# EAGLE design led_backpack_5947 (EAGLE 6.1)
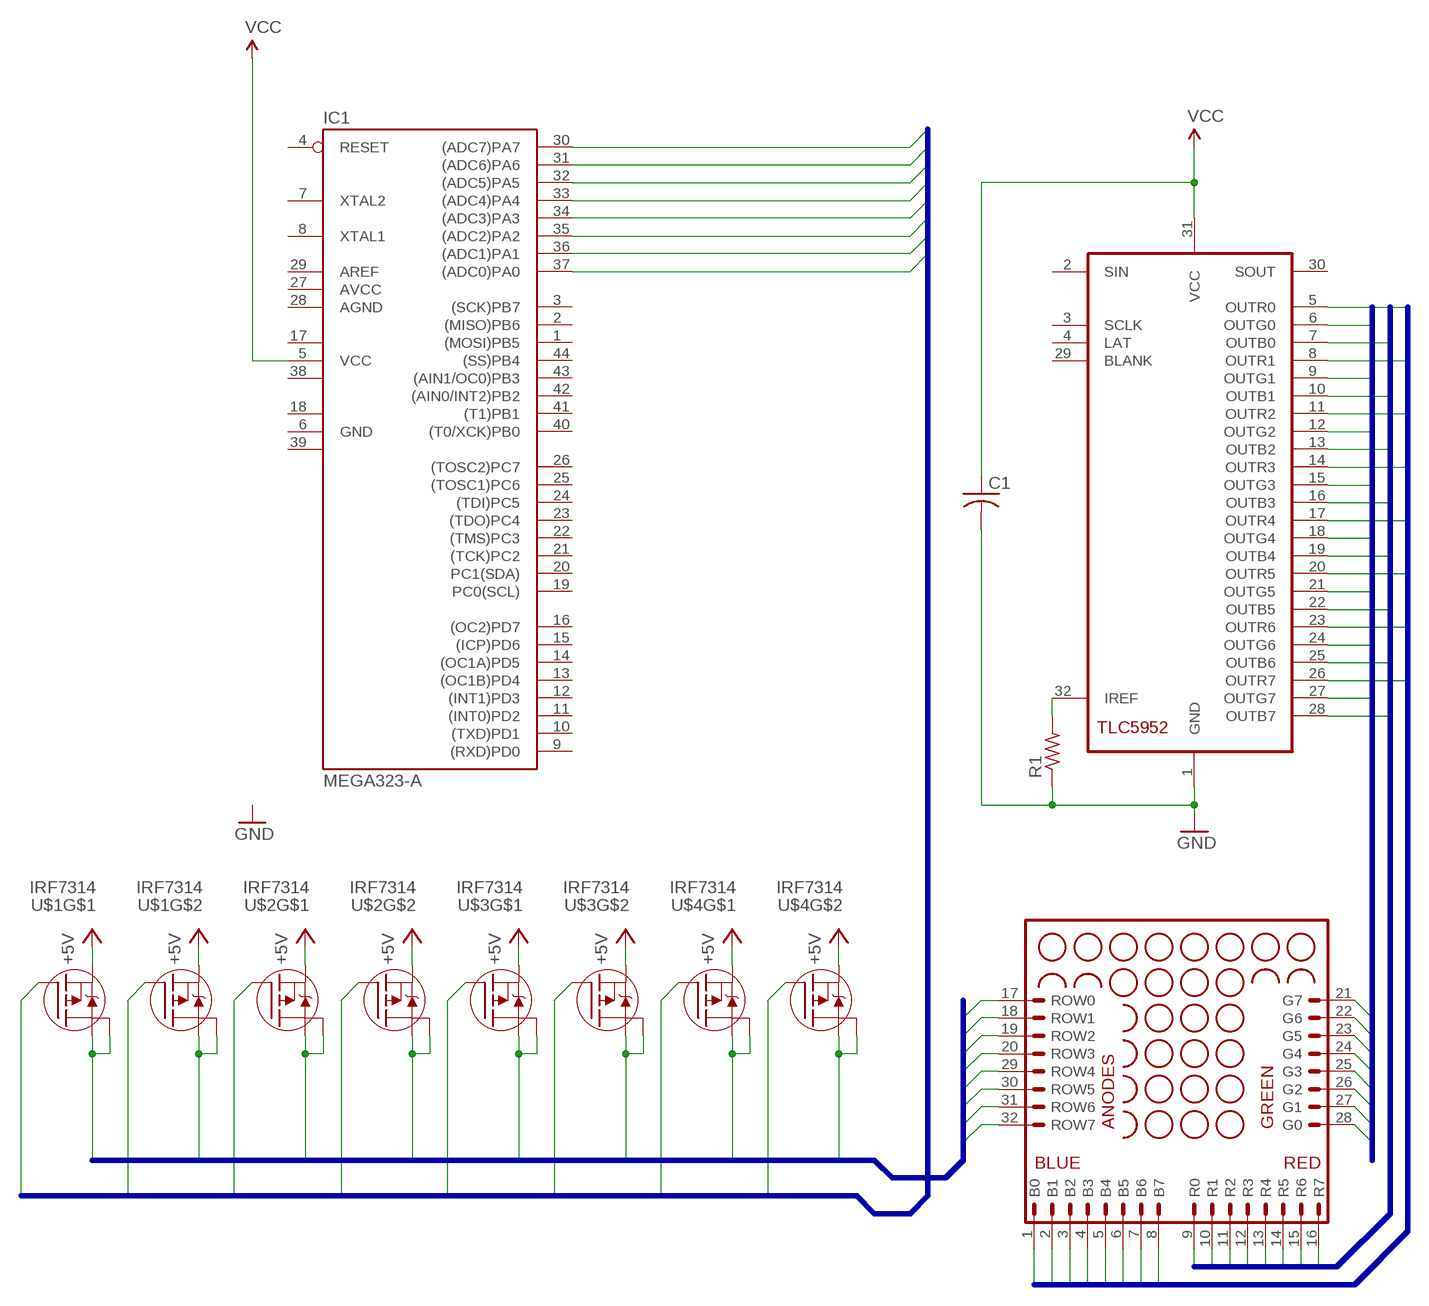
[diagram p0: schematic, sheet 1]

## Parts
C1  C-USC1206  [C1206]
IC1  MEGA323-A  [TQFP44]
MX1  MATRIX_8X8_TRICOLOR_ANODE_ROW  [MATRIX_60MM_32PIN]
R1  R-US_M1206  [M1206]
U$1  IRF7314  [SO08]
U$2  IRF7314  [SO08]
U$3  IRF7314  [SO08]
U$4  IRF7314  [SO08]
U$5  TLC5952  [HTSSOP32DAP]

## Nets
+5V: U$1.1(S) U$1.3(S) U$2.1(S) U$2.3(S) U$3.1(S) U$3.3(S) U$4.1(S) U$4.3(S)
B0: MX1.1(B0) U$5.7(OUTB0)
B1: MX1.2(B1) U$5.10(OUTB1)
B2: MX1.3(B2) U$5.13(OUTB2)
B3: MX1.4(B3) U$5.16(OUTB3)
B4: MX1.5(B4) U$5.19(OUTB4)
B5: MX1.6(B5) U$5.22(OUTB5)
B6: MX1.7(B6) U$5.25(OUTB6)
B7: MX1.8(B7) U$5.28(OUTB7)
G0: MX1.28(G0) U$5.6(OUTG0)
G1: MX1.27(G1) U$5.9(OUTG1)
G2: MX1.26(G2) U$5.12(OUTG2)
G3: MX1.25(G3) U$5.15(OUTG3)
G4: MX1.24(G4) U$5.18(OUTG4)
G5: MX1.23(G5) U$5.21(OUTG5)
G6: MX1.22(G6) U$5.24(OUTG6)
G7: MX1.21(G7) U$5.27(OUTG7)
GND: C1.2 R1.1 U$5.1(GND)
N$2: R1.2 U$5.32(IREF)
R0: MX1.9(R0) U$5.5(OUTR0)
R1: MX1.10(R1) U$5.8(OUTR1)
R2: MX1.11(R2) U$5.11(OUTR2)
R3: MX1.12(R3) U$5.14(OUTR3)
R4: MX1.13(R4) U$5.17(OUTR4)
R5: MX1.14(R5) U$5.20(OUTR5)
R6: MX1.15(R6) U$5.23(OUTR6)
R7: MX1.16(R7) U$5.26(OUTR7)
ROW_IN0: IC1.30((ADC7)PA7) U$1.2(G)
ROW_IN1: IC1.31((ADC6)PA6) U$1.4(G)
ROW_IN2: IC1.32((ADC5)PA5) U$2.2(G)
ROW_IN3: IC1.33((ADC4)PA4) U$2.4(G)
ROW_IN4: IC1.34((ADC3)PA3) U$3.2(G)
ROW_IN5: IC1.35((ADC2)PA2) U$3.4(G)
ROW_IN6: IC1.36((ADC1)PA1) U$4.2(G)
ROW_IN7: IC1.37((ADC0)PA0) U$4.4(G)
ROW_OUT0: MX1.17(ROW0) U$1.7(D) U$1.8(D)
ROW_OUT1: MX1.18(ROW1) U$1.5(D) U$1.6(D)
ROW_OUT2: MX1.19(ROW2) U$2.7(D) U$2.8(D)
ROW_OUT3: MX1.20(ROW3) U$2.5(D) U$2.6(D)
ROW_OUT4: MX1.29(ROW4) U$3.7(D) U$3.8(D)
ROW_OUT5: MX1.30(ROW5) U$3.5(D) U$3.6(D)
ROW_OUT6: MX1.31(ROW6) U$4.7(D) U$4.8(D)
ROW_OUT7: MX1.32(ROW7) U$4.5(D) U$4.6(D)
VCC: C1.1 IC1.5(VCC) U$5.31(VCC)
Unconnected: IC1.1((MOSI)PB5) IC1.2((MISO)PB6) IC1.3((SCK)PB7) IC1.4(RESET) IC1.7(XTAL2) IC1.8(XTAL1) IC1.9((RXD)PD0) IC1.10((TXD)PD1) IC1.11((INT0)PD2) IC1.12((INT1)PD3) IC1.13((OC1B)PD4) IC1.14((OC1A)PD5) IC1.15((ICP)PD6) IC1.16((OC2)PD7) IC1.19(PC0(SCL)) IC1.20(PC1(SDA)) IC1.21((TCK)PC2) IC1.22((TMS)PC3) IC1.23((TDO)PC4) IC1.24((TDI)PC5) IC1.25((TOSC1)PC6) IC1.26((TOSC2)PC7) IC1.40((T0/XCK)PB0) IC1.41((T1)PB1) IC1.42((AIN0/INT2)PB2) IC1.43((AIN1/OC0)PB3) IC1.44((SS)PB4) U$5.2(SIN) U$5.3(SCLK) U$5.4(LAT) U$5.29(BLANK) U$5.30(SOUT)

## Buses
G[0..7]
R[0..7]
B[0..7]
ROW_OUT[0..7]
ROW_IN[0..7]

## Power pins joined to a net without a drawn wire
AGND: IC1.28(AGND)
AREF: IC1.29(AREF)
AVCC: IC1.27(AVCC)
GND: IC1.6(GND)
GND1: IC1.18(GND1)
GND2: IC1.39(GND2)
VCC1: IC1.17(VCC1)
VCC2: IC1.38(VCC2)

## Library data of the parts
C1 = resistor:C-US: CAPACITOR, American symbol
IC1 = avr-6:MEGA323: MICROCONTROLLER 32 Kbytes FLASH 2 Kbytes SRAM 1 Kbytes EEPROM USART 8-channel 10 bit ADC
MX1 = matrix:MATRIX_8X8_TRICOLOR_ANODE_ROW: RGB 8x8 LED Matrix This variety of display has one anode pin for each row, and three cathode pins for each column. Each anode is shared by red, green and blue cathodes for each cell in the matrix. This part matches the matrix sold by LEDsee.com (SKU: RGBMATRIX) and Seeedstudio.com (SKU: LEDRGBMatrix). The datasheet lists the source as "Guoyexing Optoelectronics Co. Ltd.," part number GYXM-2388AURPGB.
R1 = resistor:R-US_: RESISTOR, American symbol
U$1-U$4 = led-stuff:IRF7314: Dual P-Channel HEXFET® Power MOSFET Generation V Technology Ultra Low On-Resistance Dual P-Channel MOSFET Surface Mount Fully Avalanche Rated RDS(ON) 12.5mΩ @VGS = 10V 18.6mΩ @VGS = 4.5V Maximum Ratings VGS = 12V VDS = -20V IDS = -5.3A
U$5 = led-stuff:TLC5952

## Board
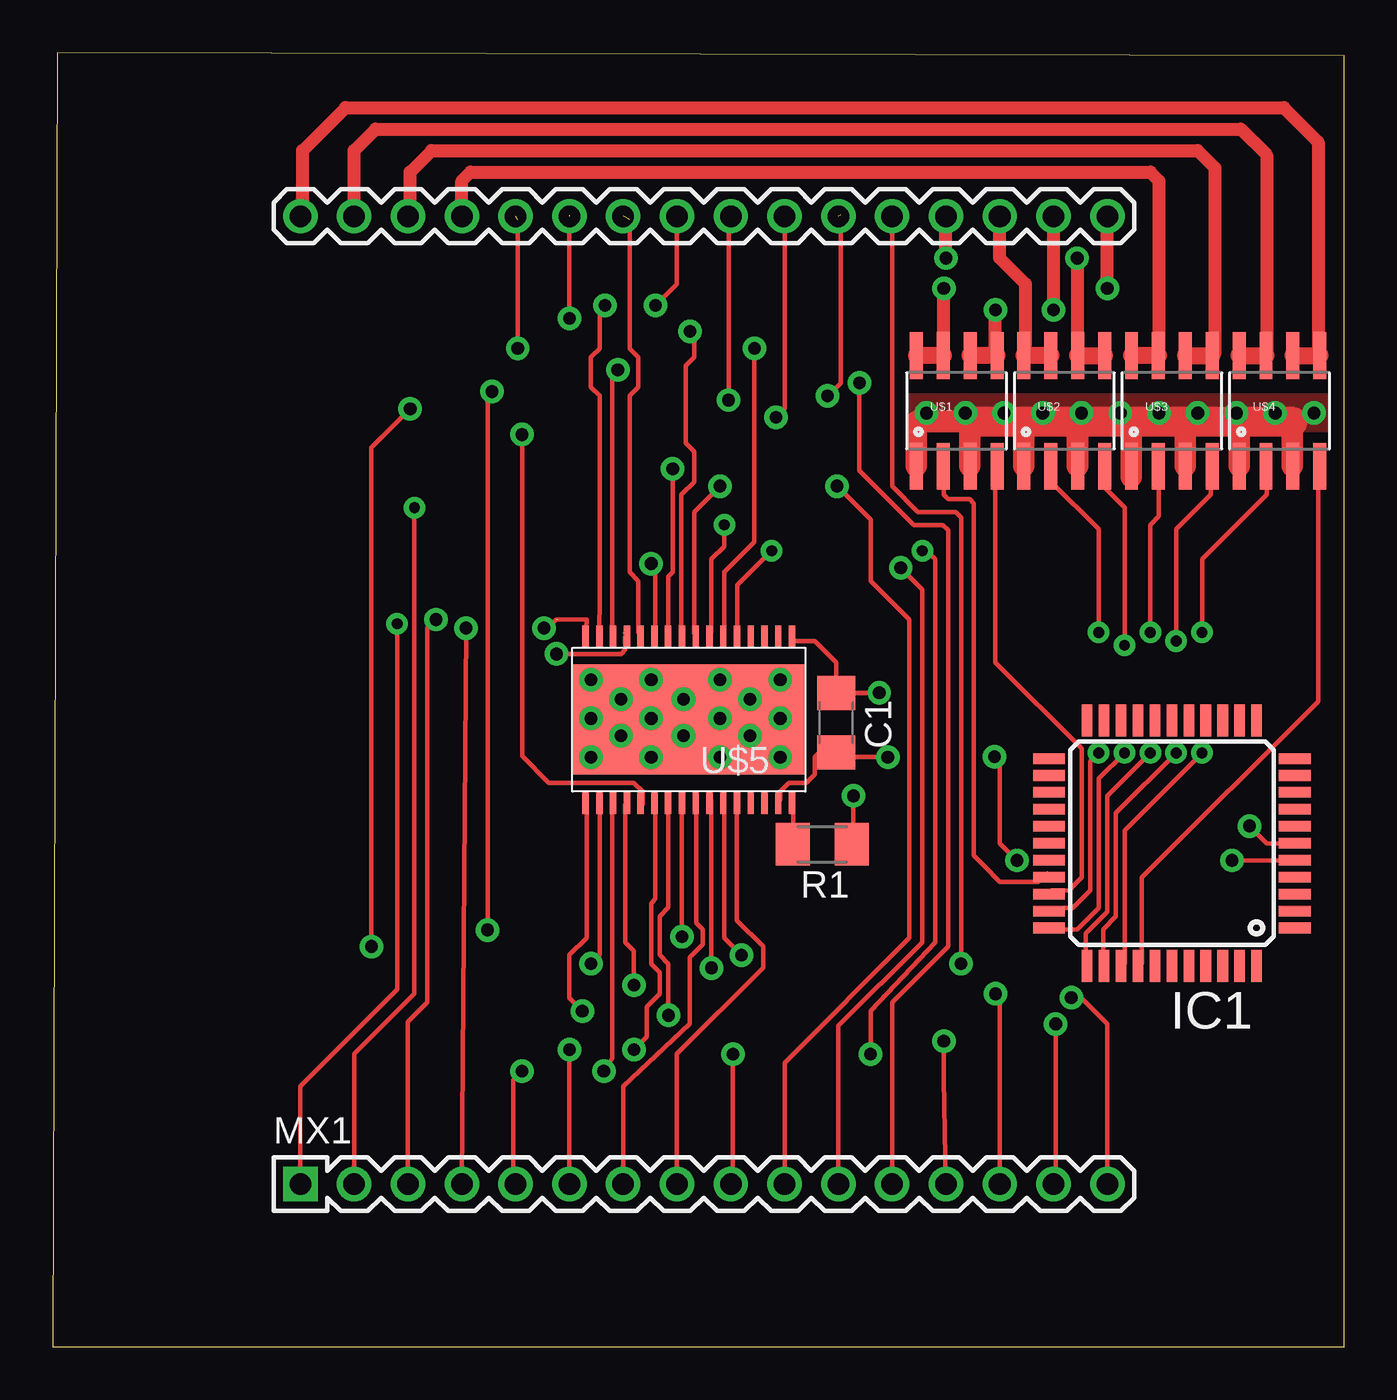
[diagram p1: board, top side]
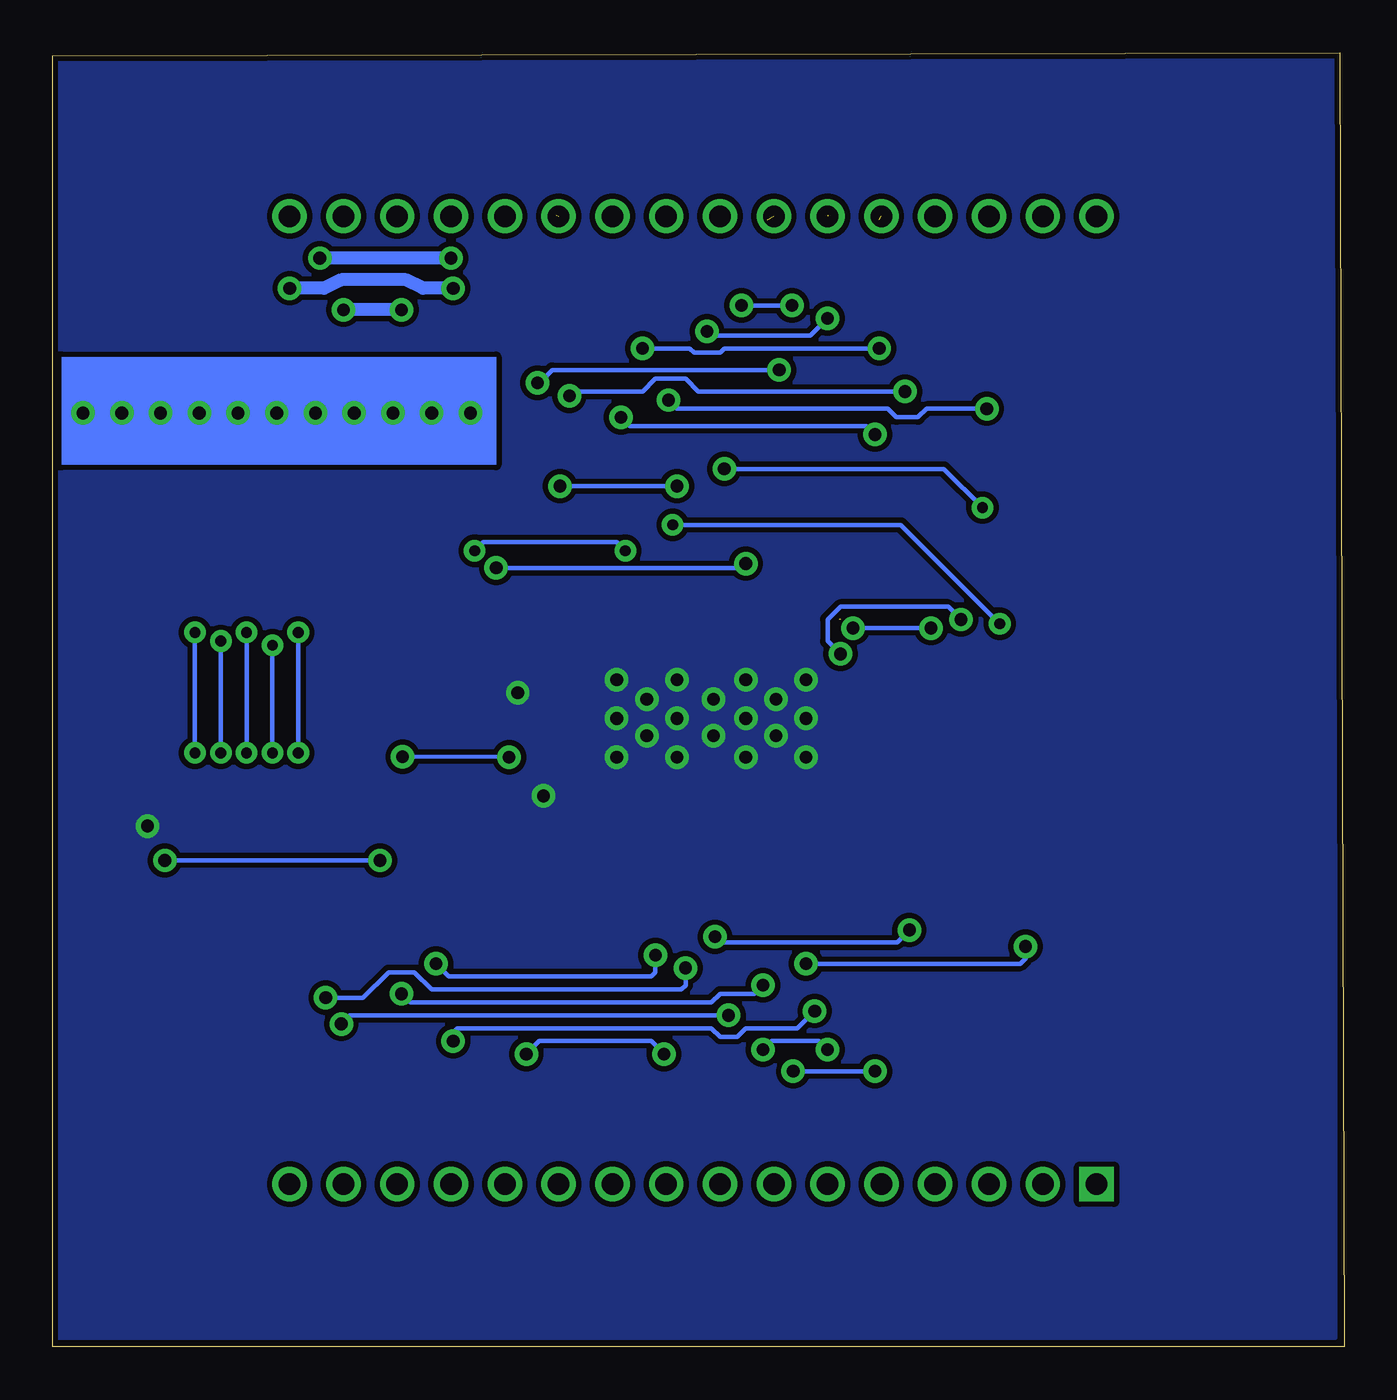
[diagram p2: board, bottom side, seen from below]

Size 60.96 x 61.1 mm. Coordinates in mm from the lower left corner, seen from the top.
Outline: 0,0 60.96,0 60.96,60.96 0.2,61.1 0,0
Copper layers (1*16): Top 0.035mm / dielectric 1.5mm / Bottom 0.035mm
Design rules: minimum track width 8mil, minimum drill 20mil, track to track 8mil, track to pad 8mil, pad to pad 8mil, via to via 8mil, smd to smd 8mil, copper to edge 10mil, drill to drill 8mil, minimum pad ring 12mil, minimum via ring 10mil, stop-mask expansion 4mil, vias tented up to drill 25mil, thermal gap 10mil

### Footprints (pad centres in the part's own frame; a part is rotated, then mirrored left to right if it is on the bottom)
C1206 = smd 1.6 x 1.8: 1 -1.4,0; 2 1.4,0
TQFP44 = smd 1.5 x 0.5: 1 -5.8,4; 2 -5.8,3.2; 3 -5.8,2.4; 4 -5.8,1.6; 5 -5.8,0.8; 6 -5.8,0; 7 -5.8,-0.8; 8 -5.8,-1.6; 9 -5.8,-2.4; 10 -5.8,-3.2; 11 -5.8,-4; 23 5.8,-4; 24 5.8,-3.2; 25 5.8,-2.4; 26 5.8,-1.6; 27 5.8,-0.8; 28 5.8,0; 29 5.8,0.8; 30 5.8,1.6; 31 5.8,2.4; 32 5.8,3.2; 33 5.8,4 | smd 0.5 x 1.5: 12 -4,-5.8; 13 -3.2,-5.8; 14 -2.4,-5.8; 15 -1.6,-5.8; 16 -0.8,-5.8; 17 0,-5.8; 18 0.8,-5.8; 19 1.6,-5.8; 20 2.4,-5.8; 21 3.2,-5.8; 22 4,-5.8; 34 4,5.8; 35 3.2,5.8; 36 2.4,5.8; 37 1.6,5.8; 38 0.8,5.8; 39 0,5.8; 40 -0.8,5.8; 41 -1.6,5.8; 42 -2.4,5.8; 43 -3.2,5.8; 44 -4,5.8
MATRIX_60MM_32PIN = drill 1.016 square: 1 -19.05,-22.86 | drill 1.016: 2 -16.51,-22.86; 3 -13.97,-22.86; 4 -11.43,-22.86; 5 -8.89,-22.86; 6 -6.35,-22.86; 7 -3.81,-22.86; 8 -1.27,-22.86; 9 1.27,-22.86; 10 3.81,-22.86; 11 6.35,-22.86; 12 8.89,-22.86; 13 11.43,-22.86; 14 13.97,-22.86; 15 16.51,-22.86; 16 19.05,-22.86; 17 19.05,22.86; 18 16.51,22.86; 19 13.97,22.86; 20 11.43,22.86; 21 8.89,22.86; 22 6.35,22.86; 23 3.81,22.86; 24 1.27,22.86; 25 -1.27,22.86; 26 -3.81,22.86; 27 -6.35,22.86; 28 -8.89,22.86; 29 -11.43,22.86; 30 -13.97,22.86; 31 -16.51,22.86; 32 -19.05,22.86
M1206 = smd 1.6 x 2: 1 -1.4,0; 2 1.4,0
SO08 = smd 0.61 x 2.21: 1 -1.905,-2.616; 2 -0.635,-2.616; 3 0.635,-2.616; 4 1.905,-2.616; 5 1.905,2.616; 6 0.635,2.616; 7 -0.635,2.616; 8 -1.905,2.616
HTSSOP32DAP = smd 0.3 x 1: 1 -4.875,-3.95; 2 -4.225,-3.95; 3 -3.575,-3.95; 4 -2.925,-3.95; 5 -2.275,-3.95; 6 -1.625,-3.95; 7 -0.975,-3.95; 8 -0.325,-3.95; 9 0.325,-3.95; 10 0.975,-3.95; 11 1.625,-3.95; 12 2.275,-3.95; 13 2.925,-3.95; 14 3.575,-3.95; 15 4.225,-3.95; 16 4.875,-3.95; 17 4.875,3.95; 18 4.225,3.95; 19 3.575,3.95; 20 2.925,3.95; 21 2.275,3.95; 22 1.625,3.95; 23 0.975,3.95; 24 0.325,3.95; 25 -0.325,3.95; 26 -0.975,3.95; 27 -1.625,3.95; 28 -2.275,3.95; 29 -2.925,3.95; 30 -3.575,3.95; 31 -4.225,3.95; 32 -4.875,3.95 | smd 11 x 5.2: EXP 0,0

### Placement (x,y rotation side)
C1  36.98,29.46 90 top
IC1  52.83,23.77 180 top
MX1  30.73,30.53 0 top
R1  36.32,23.72 180 top
U$1  42.67,44.2 0 top
U$2  47.75,44.2 0 top
U$3  52.83,44.2 0 top
U$4  57.91,44.2 0 top
U$5  30.02,29.62 180 top

### Tracks (layer width: path | path; a pad name or v marks a point on that pad's centre or on a via)
+5V  (via drill 0.6)
  Top 0.203: 43.28,41.58 U$1.3 | 45.72,43.69 45.72,41.58 U$2.1 | 48.36,41.58 U$2.3 | 50.9,41.07 U$3.1 | 53.44,43.69 53.44,41.58 U$3.3 | 56.08,41.58 U$4.1 | 58.52,41.58 U$4.3
  Top 0.406: U$1.3 43.31,43.69
  Top 0.813: U$3.1 50.93,43.69 | 56.08,43.69 56.08,41.58
  Top 1.016: 43.28,41.58 43.28,43.69 40.77,43.69 U$1.1 | U$2.1 45.85,43.69 | 48.36,43.69 48.36,41.58 | U$2.3 48.39,43.69 | 50.9,43.69 50.9,41.07 | U$3.3 53.47,43.69 | U$4.1 56.01,43.69 | 58.52,43.69 58.52,41.58
  Top 1.422: 43.31,43.69 45.72,43.69 | 45.85,43.69 48.36,43.69 | 48.39,43.69 50.9,43.69 53.44,43.69 | 53.47,43.69 56.08,43.69 | 56.01,43.69 58.52,43.69
  other vias: 41.25,44.09 59.54,44.09 57.71,44.09 55.88,44.09 54.05,44.09 52.22,44.09 50.39,44.09 48.56,44.09 46.74,44.09 44.91,44.09 43.08,44.09
  pour Top: 40.44,43.28 60.15,43.28 60.15,44.91 40.44,44.91
  pour Bottom: 40.23,45.92 60.35,45.92 60.35,42.72 60.1,42.47 40.23,42.47
B0  (via drill 0.51)
  Top 0.203: v16.26,34.14 16.26,16.87 11.68,12.29 MX1.1 | U$5.7 31.09,33.73 31.09,37.19 31.7,37.8 v31.7,38.81
  Bottom 0.203: v31.7,38.81 20.93,38.81 v16.26,34.14
B1  (via drill 0.51, 0.6)
  Top 0.203: MX1.2 14.22,13.82 17.07,16.66 v17.07,39.62 | v29.26,41.45 29.26,36.58 29.06,36.37 29.06,33.73 U$5.10
  Bottom 0.203: v29.26,41.45 18.9,41.45 v17.07,39.62
B2  (via drill 0.6)
  Top 0.203: MX1.3 16.76,15.34 17.68,16.26 17.68,33.93 v18.09,34.34 | 27.03,33.73 U$5.13 27.03,33.53 27.03,32.92 26.82,32.72 v23.77,32.72
  Bottom 0.203: v23.77,32.72 24.38,33.33 24.38,34.34 23.77,34.95 18.69,34.95 v18.09,34.34
B3  (via drill 0.6)  (1 unrouted)
  Top 0.203: MX1.4 v19.51,33.93 | U$5.16 25.2,34.34 23.82,34.34 | v23.18,33.93 23.37,33.93 23.77,34.34
  Bottom 0.203: v19.51,33.93 v23.18,33.93
B4  (via drill 0.6)
  Top 0.203: 21.74,7.52 21.74,7.72 | 21.74,7.72 21.74,12.6 v22.15,13.01 | v26.01,13.01 26.42,13.61 26.42,25.6 U$5.19 | 21.74,7.72 MX1.5
  Bottom 0.203: v22.15,13.01 v26.01,13.01
B5  (via drill 0.6)
  Top 0.203: v27.43,14.02 28.04,14.63 28.04,16.05 28.65,16.66 28.65,17.68 28.25,18.09 28.25,20.93 28.45,21.13 28.45,25.4 28.4,25.55 28.45,25.6 U$5.22 | MX1.6 v24.38,14.02
  Bottom 0.203: v24.38,14.02 24.79,14.43 27.03,14.43 v27.43,14.02
B6
  Top 0.203: MX1.7 26.92,12.29 30.07,15.24 30.07,18.39 30.68,19 30.68,19.71 30.38,20.02 30.38,25.7 U$5.25
B7
  Top 0.203: MX1.8 29.46,13.82 33.53,17.88 33.53,18.9 32.3,20.13 U$5.28
G0  (via drill 0.6)  (1 unrouted)
  Top 0.203: U$5.6 31.7,33.73 31.7,36.58 33.12,38 v33.12,47.14 | v21.95,47.14 21.95,53.24
  Bottom 0.203: v33.12,47.14 30.89,47.14 30.68,46.94 29.46,46.94 29.26,47.14 v21.95,47.14
G1  (via drill 0.6)  (1 unrouted)
  Top 0.203: U$5.9 29.67,33.73 29.67,40.23 30.28,40.84 30.28,42.27 29.87,42.67 29.87,46.33 30.28,46.74 30.28,47.75 v30.07,47.95 | v24.38,48.56 24.38,53.44
  Bottom 0.203: v30.07,47.95 29.87,47.95 29.67,47.75 25.2,47.75 v24.38,48.56
G2  (1 unrouted)
  Top 0.203: U$5.12 27.64,33.73 27.64,36.17 27.23,36.58 27.23,44.91 27.64,45.31 27.64,46.74 27.23,47.14 27.23,53.24
G3  (via drill 0.6)
  Top 0.203: v26.06,49.17 25.81,48.92 25.81,47.14 25.4,46.74 25.4,45.31 25.81,44.91 25.81,35.56 U$5.15 | MX1.25 29.46,50.19 v28.45,49.17
  Bottom 0.203: v28.45,49.17 v26.06,49.17
G4  (via drill 0.6)
  Top 0.203: v25.4,18.09 25.81,18.49 25.81,25.6 U$5.18 | v15.04,18.9 15.04,42.47 v16.87,44.3 | v31.9,44.7 31.9,53.29 MX1.24
  Bottom 0.203: v25.4,18.09 15.29,18.09 15.04,18.34 v15.04,18.9 | v16.87,44.3 19.71,44.3 20.12,43.89 21.13,43.89 21.54,44.3 31.5,44.3 v31.9,44.7
G5  (via drill 0.6)
  Top 0.203: 27.84,25.81 27.84,26.21 27.43,26.62 23.42,26.62 22.15,27.89 v22.15,43.08 | 27.84,25.81 27.84,25.6 | 27.84,25.81 U$5.21 | v34.14,43.89 34.54,44.3 MX1.23
  Bottom 0.203: v22.15,43.08 22.55,43.48 33.73,43.48 v34.14,43.89
G6  (via drill 0.6)  (1 unrouted)
  Top 0.203: U$5.24 v29.7,19.36 | v20.52,19.68 20.52,44.91 v20.73,45.11 | v36.58,44.91 37.19,45.52 37.19,53.44
  Bottom 0.203: v29.7,19.36 29.44,19.1 21.1,19.1 v20.52,19.68 | v36.58,44.91 36.37,44.91 36.17,45.11 33.12,45.11 32.51,45.72 31.09,45.72 30.48,45.11 v20.73,45.11
G7  (via drill 0.6)
  Top 0.203: v42.88,18.09 42.88,39.17 42.62,39.42 40.84,39.42 39.62,40.64 MX1.21 | v32.51,18.49 31.7,19.3 31.7,25.6 U$5.27
  Bottom 0.203: v32.51,18.49 32.51,17.68 32.72,17.48 42.27,17.48 v42.88,18.09
GND  (via drill 0.6)
  Top 0.203: U$5.1 arc90 35.14,33.33 35.97,33.33 36.98,32.31 C1.2 38.99,30.86 arc90 v39.01,30.89 | R1.1 37.8,23.8 v37.8,26.01 | IC1.6 57.3,23.77 v56.49,24.59
  other vias: 25.4,31.5 25.4,29.67 25.4,27.84 26.82,30.58 26.82,28.85 28.24,31.5 28.24,29.67 28.24,27.84 29.77,30.58 29.77,28.85 31.5,31.5 31.5,29.67 31.5,27.84 32.92,30.58 32.92,28.85 34.34,31.5 34.34,29.67 34.34,27.84
  pour Bottom (isolate 0.254): 0.41,60.76 60.76,60.76 60.76,0.41 0.41,0.41
N$2
  Top 0.203: R1.2 34.95,23.77 34.95,25.6 U$5.32
R0  (via drill 0.51, 0.6)
  Top 0.203: v32.11,13.82 32.11,8.33 MX1.9 | v38.61,13.82 38.61,15.85 41.66,19.1 41.66,37.19 41.25,37.59 v41.05,37.59 | v33.93,37.59 32.31,35.97 32.31,33.73 U$5.5
  Bottom 0.203: v32.11,13.82 32.72,14.43 38,14.43 v38.61,13.82 | v41.05,37.59 40.64,38 34.34,38 v33.93,37.59
R1  (via drill 0.6)
  Top 0.203: v37.02,40.64 38.61,39.05 38.61,36.17 40.44,34.34 40.44,19.3 34.54,13.41 MX1.10 | U$5.8 30.28,33.73 30.28,39.42 v31.5,40.64
  Bottom 0.203: v37.02,40.64 v31.5,40.64
R2  (via drill 0.6)
  Top 0.203: MX1.11 37.08,15.14 41.05,19.1 41.05,35.76 v40.03,36.78 | v28.25,36.98 28.45,36.78 28.45,33.73 U$5.11
  Bottom 0.203: v40.03,36.78 28.45,36.78 v28.25,36.98
R3  (via drill 0.6)
  Top 0.203: MX1.12 39.62,16.26 42.27,18.9 42.27,38.56 42.01,38.81 40.64,38.81 38.08,41.37 v38.08,45.52 | U$5.14 26.42,33.6 26.42,46.13 v26.67,46.13
  Bottom 0.203: v38.08,45.52 38,45.52 37.39,46.13 v26.67,46.13
R4  (via drill 0.6)
  Top 0.203: v24.99,15.85 24.38,16.46 24.38,18.49 25.2,19.3 25.2,25.6 U$5.17 | MX1.13 42.06,12.65 v42.06,14.43
  Bottom 0.203: v24.99,15.85 25.81,15.04 28.25,15.04 28.65,14.63 29.46,14.63 29.87,15.04 41.86,15.04 42.06,14.83 v42.06,14.43
R5  (via drill 0.6)
  Top 0.203: MX1.14 44.7,16.26 v44.5,16.66 | v27.43,17.07 27.43,18.69 27.03,19.1 27.02,24.6 27.02,25.6 | 27.02,25.6 27.02,25.61 | U$5.20 27.03,25.6 27.02,25.6
  Bottom 0.203: v27.43,17.07 27.84,16.66 29.46,16.66 29.87,16.26 44.09,16.26 v44.5,16.66
R6  (via drill 0.6)
  Top 0.203: v47.35,15.24 47.35,8.33 MX1.15 | U$5.23 29.05,20.74 28.65,20.32 28.65,18.49 29.06,18.09 v29.06,15.65
  Bottom 0.203: v47.35,15.24 46.94,15.65 v29.06,15.65
R7  (via drill 0.6)
  Top 0.203: v48.08,16.48 48.54,16.48 49.78,15.24 MX1.16 | v31.09,17.88 31.09,25.81 U$5.26
  Bottom 0.203: v48.08,16.48 47.68,16.46 46.33,16.46 45.11,17.68 43.89,17.68 43.08,16.87 31.29,16.87 31.09,17.07 v31.09,17.88
ROW_IN0
  Top 0.203: IC1.30 46.94,22.35 46.53,21.95 44.7,21.95 44.32,22.33 44.32,22.35 43.48,23.19 43.48,39.83 43.28,40.03 42.27,40.03 42.06,40.23 42.06,41.45 U$1.2
ROW_IN1
  Top 0.203: IC1.31 47.14,21.54 47.95,21.54 48.56,22.15 48.56,28.25 44.5,32.31 44.5,41.45 U$1.4
ROW_IN2  (via drill 0.51)
  Top 0.203: v49.38,28.04 48.97,27.64 48.97,21.54 48.16,20.73 47.14,20.73 IC1.32 | v49.38,33.73 49.38,38.61 47.14,40.84 47.14,41.45 U$2.2
  Bottom 0.203: v49.38,33.73 v49.38,28.04
ROW_IN3  (via drill 0.51)
  Top 0.203: v50.6,28.04 49.38,26.82 49.38,20.73 48.36,19.71 47.14,19.71 IC1.33 | v50.6,33.12 50.6,39.62 49.58,40.64 49.58,41.45 U$2.4
  Bottom 0.203: v50.6,33.12 v50.6,28.04
ROW_IN4  (via drill 0.51)
  Top 0.203: v51.82,28.04 49.78,26.01 49.78,20.52 48.77,19.51 48.77,18.09 IC1.34 | v51.82,33.73 51.82,38.81 52.22,39.22 52.22,41.45 U$3.2
  Bottom 0.203: v51.82,33.73 v51.82,28.04
ROW_IN5  (via drill 0.51)
  Top 0.203: v53.03,28.04 50.19,25.2 50.19,20.32 49.58,19.71 49.58,18.09 IC1.35 | v53.03,33.33 53.03,38.61 54.66,40.23 54.66,41.45 U$3.4
  Bottom 0.203: v53.03,33.33 v53.03,28.04
ROW_IN6  (via drill 0.51)
  Top 0.203: v54.25,28.04 50.6,24.38 50.6,18.09 IC1.36 | v54.25,33.73 54.25,37.19 57.3,40.23 57.3,41.45 U$4.2
  Bottom 0.203: v54.25,33.73 v54.25,28.04
ROW_IN7
  Top 0.203: IC1.37 51.41,18.09 51.41,22.15 59.74,30.48 59.74,41.45 U$4.4
ROW_OUT0  (via drill 0.6)
  Top 0.203: U$1.7 42.06,46.81
  Top 0.61: v49.78,49.99 MX1.17 | 42.06,46.81 v42.06,49.99
  Top 0.813: U$1.7 U$1.8
  Bottom 0.61: v42.06,49.99 43.48,49.99 44.3,50.39 47.35,50.39 48.16,49.99 v49.78,49.99
ROW_OUT1  (via drill 0.6)
  Top 0.203: U$1.5 44.5,46.81
  Top 0.61: v47.24,48.97 MX1.18 | 44.5,46.81 v44.5,48.97
  Top 0.813: U$1.5 U$1.6
  Bottom 0.61: v44.5,48.97 v47.24,48.97
ROW_OUT2
  Top 0.203: 45.92,47.35 45.72,47.35 45.72,46.81 U$2.8
  Top 0.61: MX1.19 44.7,51.41 45.92,50.19 45.92,47.35
  Top 0.813: U$2.7 U$2.8
ROW_OUT3  (via drill 0.6)
  Top 0.203: 48.36,46.81 U$2.6
  Top 0.61: v42.16,51.41 MX1.20 | v48.36,51.41 48.36,46.81
  Top 0.813: U$2.6 U$2.5
  Bottom 0.61: v42.16,51.41 v48.36,51.41
ROW_OUT4
  Top 0.203: 52.22,47.14 U$3.7
  Top 0.61: 52.22,47.14 52.22,55.07 51.82,55.47 19.71,55.47 19.3,55.07 MX1.29
  Top 0.813: U$3.7 U$3.8
ROW_OUT5
  Top 0.203: MX1.30 16.87,53.44 | 54.86,46.94 U$3.6
  Top 0.61: 16.87,53.44 16.87,55.47 17.88,56.49 54.05,56.49 54.86,55.68 54.86,46.94
  Top 0.813: U$3.6 U$3.5
ROW_OUT6
  Top 0.203: 57.3,46.94 U$4.8
  Top 0.61: 57.3,46.94 57.3,56.29 56.08,57.51 15.24,57.51 14.22,56.49 MX1.31
  Top 0.813: U$4.8 U$4.7
ROW_OUT7
  Top 0.203: MX1.32 11.79,53.44 | 59.74,46.94 U$4.6
  Top 0.61: 11.79,53.44 11.79,56.49 13.82,58.52 58.12,58.52 59.74,56.9 59.74,46.94
  Top 0.813: U$4.6 U$4.5
VCC  (via drill 0.6)
  Top 0.203: IC1.5 58.52,22.96 v55.68,22.96 | U$5.31 34.34,25.81 34.34,26.21 34.75,26.62 35.56,26.62 35.97,27.03 35.97,27.84 36.17,28.04 36.98,28.04 C1.1 37.21,27.84 v39.42,27.84 | v44.45,27.86 44.7,27.61 44.7,23.77 v45.52,22.96
  Bottom 0.203: v39.42,27.84 v44.45,27.86 | v45.52,22.96 v55.68,22.96
(copper drawn outside any net)
  shapes: Bottom area x1